# EAGLE design RH009.1 (EAGLE 7.1.0)
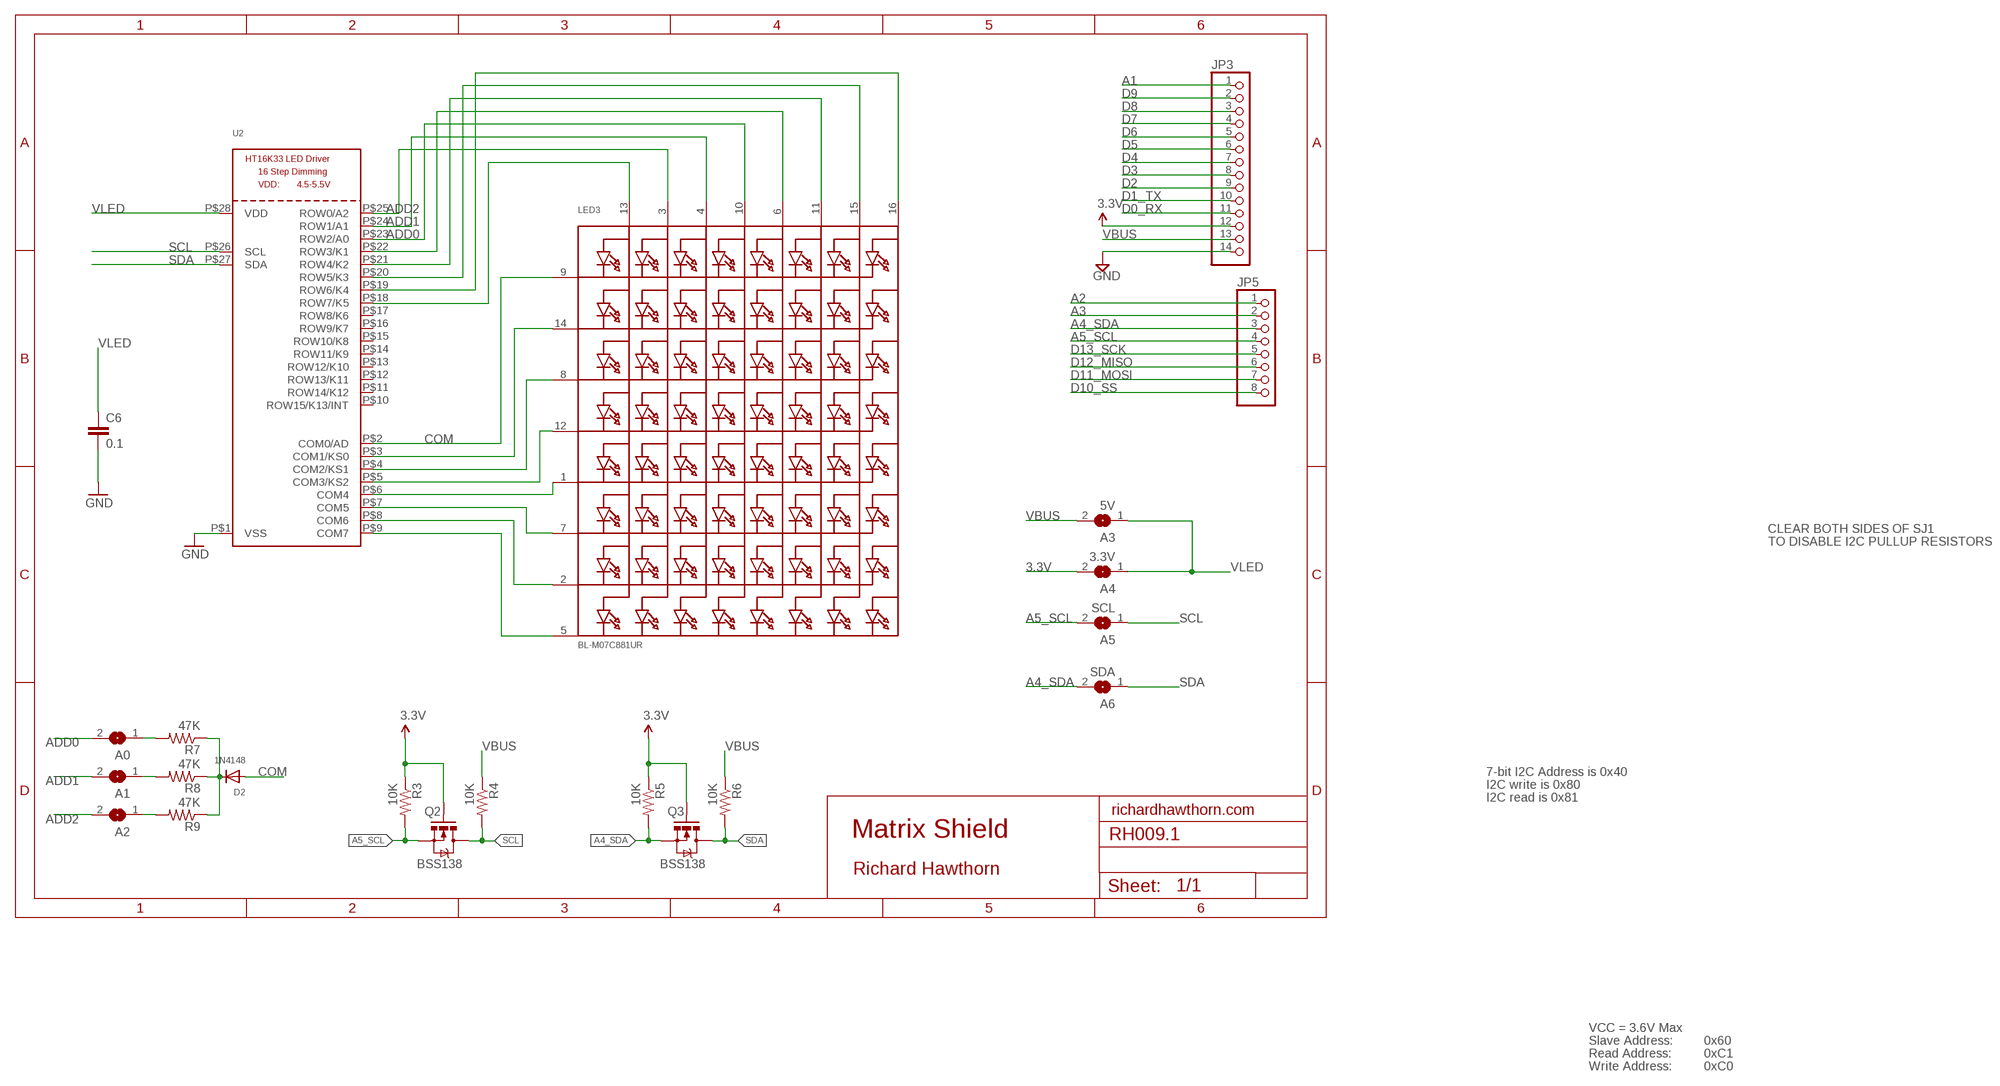
[diagram p0: schematic, sheet 1]

## Parts
A0  SOLDERJUMPERREFLOW_NOPASTE  [SOLDERJUMPER_REFLOW_NOPASTE]
A1  SOLDERJUMPERREFLOW_NOPASTE  [SOLDERJUMPER_REFLOW_NOPASTE]
A2  SOLDERJUMPERREFLOW_NOPASTE  [SOLDERJUMPER_REFLOW_NOPASTE]
A3  5V  SOLDERJUMPERREFLOW_NOPASTE  [SOLDERJUMPER_REFLOW_NOPASTE]
A4  3.3V  SOLDERJUMPERREFLOW_NOPASTE  [SOLDERJUMPER_REFLOW_NOPASTE]
A5  SCL  SOLDERJUMPERREFLOW_NOPASTE  [SOLDERJUMPER_REFLOW_NOPASTE]
A6  SDA  SOLDERJUMPERREFLOW_NOPASTE  [SOLDERJUMPER_REFLOW_NOPASTE]
C6  0.1  CAP0603-CAP  [0603-CAP]
D2  1N4148  DIODESOD-323F  [SOD-323F]
JP3  PINHD-1X14  [1X14]
JP5  PINHD-1X8  [1X08]
LED3  BL-M07C881UR  DISP_SEGMENT_8X8_ROWCATHODEM12A881UR  [SEGMENT_BL-M12A881UR]
Q2  BSS138  MOSFET-NCHANNELSMD  [SOT23-3]
Q3  BSS138  MOSFET-NCHANNELSMD  [SOT23-3]
R3  10K  RESISTOR0603-RES  [0603-RES]
R4  10K  RESISTOR0603-RES  [0603-RES]
R5  10K  RESISTOR0603-RES  [0603-RES]
R6  10K  RESISTOR0603-RES  [0603-RES]
R7  47K  R-US_R0805  [R0805]
R8  47K  R-US_R0805  [R0805]
R9  47K  R-US_R0805  [R0805]
U2  HT16K33_SOP28  [SOP28_300MIL]

## Nets
3.3V: A4.2 JP3.12 Q2.1(G) Q3.1(G) R3.1 R5.1
A1: JP3.1
A2: JP5.1
A3: JP5.2
A4_SDA: A6.2 JP5.3 Q3.2(S) R5.2
A5_SCL: A5.2 JP5.4 Q2.2(S) R3.2
ADD0: A0.2 LED3.10(A4) U2.P$23(ROW2/A0)
ADD1: A1.2 LED3.4(A3) U2.P$24(ROW1/A1)
ADD2: A2.2 LED3.3(A2) U2.P$25(ROW0/A2)
COM: D2.A LED3.9(K1) U2.P$2(COM0/AD)
D0_RX: JP3.11
D1_TX: JP3.10
D2: JP3.9
D3: JP3.8
D4: JP3.7
D5: JP3.6
D6: JP3.5
D7: JP3.4
D8: JP3.3
D9: JP3.2
D10_SS: JP5.8
D11_MOSI: JP5.7
D12_MISO: JP5.6
D13_SCK: JP5.5
GND [power]: C6.2 JP3.14 U2.P$1(VSS)
N$4: LED3.5(K8) U2.P$9(COM7)
N$5: A0.1 R7.2
N$6: LED3.2(K7) U2.P$8(COM6)
N$14: LED3.7(K6) U2.P$7(COM5)
N$17: D2.C R7.1 R8.1 R9.1
N$18: A2.1 R9.2
N$19: A1.1 R8.2
N$22: LED3.1(K5) U2.P$6(COM4)
N$23: LED3.12(K4) U2.P$5(COM3/KS2)
N$24: LED3.8(K3) U2.P$4(COM2/KS1)
N$25: LED3.14(K2) U2.P$3(COM1/KS0)
N$27: LED3.6(A5) U2.P$22(ROW3/K1)
N$28: LED3.11(A6) U2.P$21(ROW4/K2)
N$29: LED3.13(A1) U2.P$18(ROW7/K5)
SCL: A5.1 Q2.3(D) R4.2 U2.P$26(SCL)
SDA: A6.1 Q3.3(D) R6.2 U2.P$27(SDA)
SEG_F: LED3.15(A7) U2.P$20(ROW5/K3)
SEG_G: LED3.16(A8) U2.P$19(ROW6/K4)
VBUS [power]: A3.2 JP3.13 R4.1 R6.1
VLED [power]: A3.1 A4.1 C6.1 U2.P$28(VDD)
Unconnected: U2.P$10(ROW15/K13/INT) U2.P$11(ROW14/K12) U2.P$12(ROW13/K11) U2.P$13(ROW12/K10) U2.P$14(ROW11/K9) U2.P$15(ROW10/K8) U2.P$16(ROW9/K7) U2.P$17(ROW8/K6)

## Notes on the sheet
- CLEAR BOTH SIDES OF SJ1
- TO DISABLE I2C PULLUP RESISTORS
- 7-bit I2C Address is 0x40
- I2C write is 0x80
- I2C read is 0x81
- richardhawthorn.com
- Matrix Shield
- Richard Hawthorn
- VCC = 3.6V Max
- Slave Address: | 0x60
- Read Address: | 0xC1
- Write Address: | 0xC0

## Library data of the parts
A0 A1-A6 = microbuilder:SOLDERJUMPER: SMD Solder JUMPER Solder the two pads together to create a connection, or remove the solder to break it. REFLOW - Use this footprint for solder paste and reflow ovens. WAVE - Use this footprint for hand-soldering (larger pads). CLOSED - Has a trace between the two pads to ensure it is closed by default. The trace needs to be cut to disable the jumper, and can be closed again by creating a solder bridge between the two pads.
C6 = LowPowerLab:CAP: Capacitor Standard 0603 ceramic capacitor, and 0.1" leaded capacitor.
D2 = adafruit:DIODE: Diode SMADIODE - SMA Surface Mount Package 20V 1A Schottky Diode Digikey: 641-1014-6-ND DO-1N4148 - Through Hole Small Current Diode SOD-123 20V 1 A (.5mV Vf) Schottky Diode - Digikey: MBRX120TPMSCT-ND SOD-323 10V 570mA (.38mV Vf, 3ns) Schottky Diode - Digikey: ZLLS410CT-ND SOD-523 30V 30mA Schottky Diode (RB751S-40TE61) - Digikey: RB751S-40TE61CT-ND SOT23-R/W - SOT23 Package (R = Solder Paste/Reflow Ovens, W = Hand-Soldering) BAT54Film 40V 300mA - Digikey: 497-7162-1-ND
JP3 = pinhead:PINHD-1X14: PIN HEADER
JP5 = pinhead:PINHD-1X8: PIN HEADER
LED3 = microbuilder:DISP_SEGMENT_8X8_ROWCATHODE: 8x8 LED Segment Displays: Row = Cathode 0.7" Red 8X8 Matrix, 1.9mm Round LEDs - BL-M07C881UR 1.2" Red 8x8 Matrix, 3.0mm Round LEDs - BL-M12A881UR 1.2" Red 8x8 Matrix, 3.0mm Square LEDs - BL-M12A883
Q2 Q3 = SparkFun:MOSFET-NCHANNEL
R3-R6 = SparkFun:RESISTOR: Resistor Basic schematic elements and footprints for 0603, 1206, and PTH resistors.
R7-R9 = adafruit:R-US_: RESISTOR, American symbol
U2 = microbuilder:HT16K33_SOP28

## Net classes
1 power: width 0.381 mm, clearance 0.254 mm

## Board
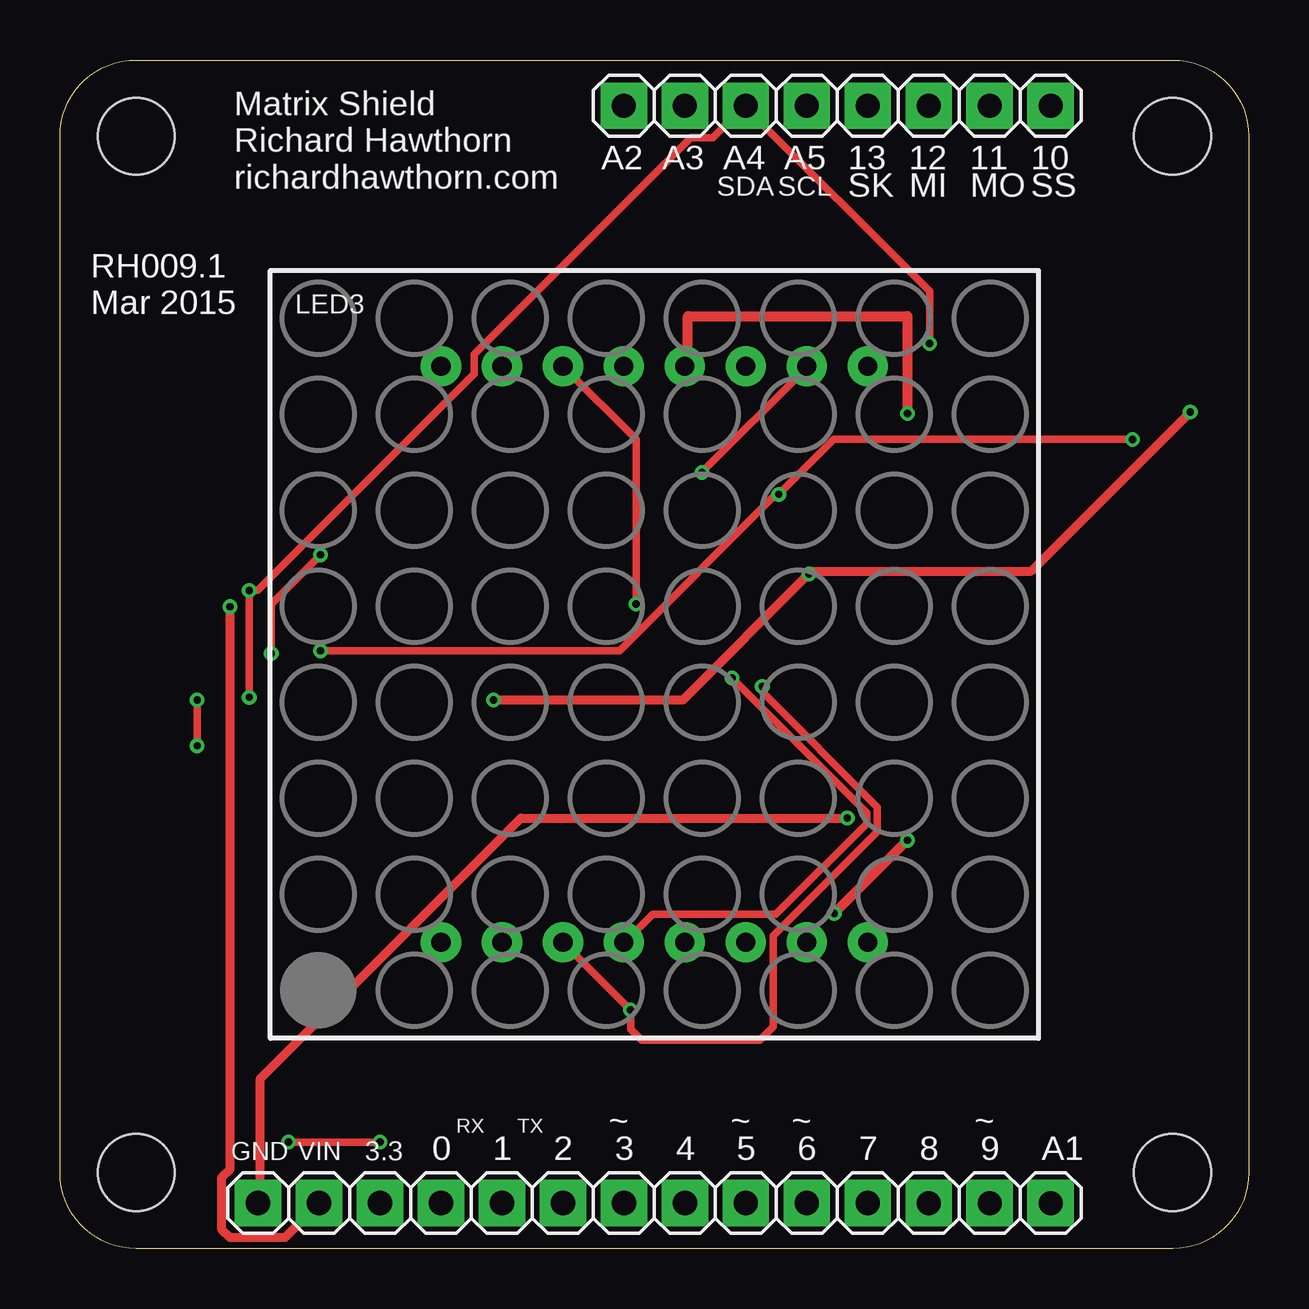
[diagram p1: board, top side]
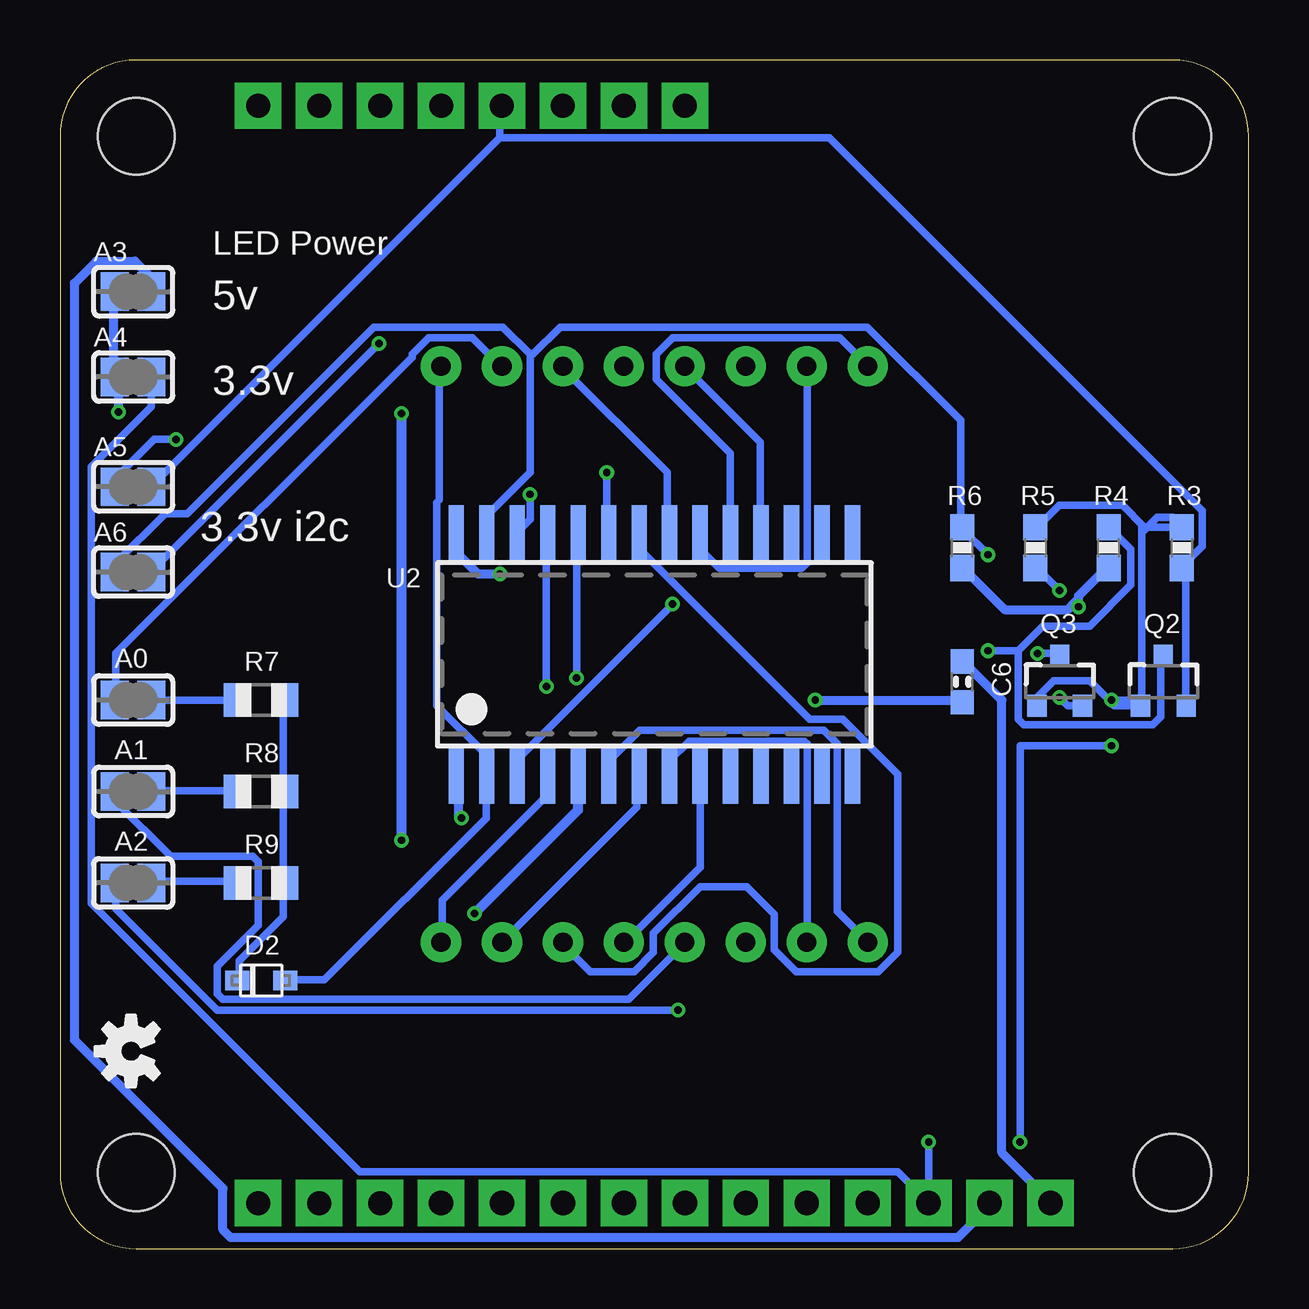
[diagram p2: board, bottom side, seen from below]

Size 49.53 x 49.53 mm. Coordinates in mm from the lower left corner, seen from the top.
Outline: 0,3.17 0,46.35 arc-90 3.17,49.53 46.35,49.53 arc-90 49.53,46.35 49.53,3.17 arc-90 46.35,0 3.17,0 arc-90 0,3.17
Copper layers (1*16): Top 0.035mm / dielectric 1.5mm / Bottom 0.035mm
Design rules "ITEADstudio_DRC *": minimum track width 12mil, minimum drill 12mil, track to track 6mil, track to pad 6mil, pad to pad 6mil, via to via 6mil, smd to smd 0mil, copper to edge 10mil, drill to drill 10mil, minimum pad ring 10mil, minimum via ring 6mil, stop-mask expansion 2mil, vias tented up to drill 100mil, thermal gap 15mil
Holes 3.2 mm at 3.17,3.17 46.35,3.17 3.17,46.35 46.35,46.35
tKeepout: area 0,0 to 5.7,5.7; area 43.8,0 to 49.5,5.7; area 43.8,43.8 to 49.5,49.5; area 0,43.8 to 5.7,49.5
bKeepout: area 0,43.8 to 5.7,49.5; area 43.8,43.8 to 49.5,49.5; area 43.8,0 to 49.5,5.7; area 0,0 to 5.7,5.7
tRestrict: area 24.3,8.9 to 29.1,12.8; area 5.8,16.9 to 6.9,18.5; area 5.2,9.7 to 6.7,10.4
bRestrict: area 27.4,17.7 to 29.2,18.7; area 21.1,13.8 to 22.9,14.9; area 21.6,12.6 to 22.1,13.2; area 20.7,12.6 to 21.2,13.2; area 20.2,12.8 to 20.7,13.5; area 20.1,13.4 to 20.6,14; area 26.5,18.9 to 27.1,19.5; area 26.5,17.9 to 27.1,18.5; area 27.5,19.1 to 28,19.8; area 27.9,18.8 to 29.1,19.6

### Footprints (pad centres in the part's own frame; a part is rotated, then mirrored left to right if it is on the bottom)
SOLDERJUMPER_REFLOW_NOPASTE = smd 1.168 x 1.6: 1 -0.762,0; 2 0.762,0
0603-CAP = smd 1.016 x 0.965: 1 -0.85,0; 2 0.85,0
SOD-323F = smd 1 x 0.8: A -1,0; C 1,0
1X14 = drill 1 pad 1.93 square: 1 -16.51,0; 2 -13.97,0; 3 -11.43,0 | drill 1.016 pad 1.93 square: 4 -8.89,0; 5 -6.35,0; 6 -3.81,0; 7 -1.27,0; 8 1.27,0; 9 3.81,0; 10 6.35,0; 11 8.89,0; 12 11.43,0; 13 13.97,0; 14 16.51,0
1X08 = drill 1 pad 1.93 square: 1 -8.89,0; 2 -6.35,0; 3 -3.81,0; 4 -1.27,0; 5 1.27,0; 6 3.81,0; 7 6.35,0; 8 8.89,0
SEGMENT_BL-M12A881UR = drill 0.8 pad 1.676: 1 -8.89,-12; 2 -6.35,-12; 3 -3.81,-12; 4 -1.27,-12; 5 1.27,-12; 6 3.81,-12; 7 6.35,-12; 8 8.89,-12; 9 8.89,12; 10 6.35,12; 11 3.81,12; 12 1.27,12; 13 -1.27,12; 14 -3.81,12; 15 -6.35,12; 16 -8.89,12
SOT23-3 = smd 0.8 x 0.9: 1 -0.95,-1; 2 0.95,-1; 3 0,1.1
0603-RES = smd 1.1 x 1: 1 -0.85,0; 2 0.85,0
R0805 = smd 1.1 x 1.4: 1 -1,0; 2 1,0
SOP28_300MIL = smd 0.635 x 2.286: P$1 -8.255,-5.08; P$2 -6.985,-5.08; P$3 -5.715,-5.08; P$4 -4.445,-5.08; P$5 -3.175,-5.08; P$6 -1.905,-5.08; P$7 -0.635,-5.08; P$8 0.635,-5.08; P$9 1.905,-5.08; P$10 3.175,-5.08; P$11 4.445,-5.08; P$12 5.715,-5.08; P$13 6.985,-5.08; P$14 8.255,-5.08; P$15 8.255,5.08; P$16 6.985,5.08; P$17 5.715,5.08; P$18 4.445,5.08; P$19 3.175,5.08; P$20 1.905,5.08; P$21 0.635,5.08; P$22 -0.635,5.08; P$23 -1.905,5.08; P$24 -3.175,5.08; P$25 -4.445,5.08; P$26 -5.715,5.08; P$27 -6.985,5.08; P$28 -8.255,5.08

### Placement (x,y rotation side)
A0  46.48,22.86 180 bottom
A1  46.48,19.05 180 bottom
A2  46.48,15.24 180 bottom
A3  46.48,39.88 0 bottom
A4  46.48,36.32 0 bottom
A5  46.48,31.75 0 bottom
A6  46.48,28.19 0 bottom
C6  11.94,23.62 90 bottom
D2  41.15,11.18 180 bottom
JP3  24.77,1.91 180 top
JP5  32.38,47.62 0 top
LED3  24.77,24.77 0 top
Q2  3.56,23.62 0 bottom
Q3  7.87,23.62 0 bottom
R3  2.79,29.21 270 bottom
R4  5.84,29.21 90 bottom
R5  8.89,29.21 270 bottom
R6  11.94,29.21 90 bottom
R7  41.15,22.86 180 bottom
R8  41.15,19.05 180 bottom
R9  41.15,15.24 180 bottom
U2  24.77,24.77 0 bottom
U$3  [OSHW-LOGO-S]  46.57,8.23 90 bottom

### Tracks (layer width: path | path; a pad name or v marks a point on that pad's centre or on a via)
3.3V  (via drill 0.3)
  Top 0.305: v5.71,20.95 v5.71,22.86 | v13.34,4.45 v9.53,4.45
  Bottom 0.305: A4.2 45.72,35.09 48.23,32.58 48.23,14.4 37.03,3.2 14.63,3.2 JP3.12 v13.34,4.45 | 4.57,22.63 5.6,22.63 5.77,22.8 | 5.77,22.8 6.63,23.66 8.12,23.66 8.8,22.97 8.8,22.63 Q3.1 | 4.34,30.06 2.86,30.06 | 4.34,30.06 5.26,30.98 7.89,30.98 8.8,30.06 R5.1 | 4.46,29.84 4.46,30.06 4.34,30.06 | 4.46,29.84 4.46,22.86 | 4.46,22.86 4.46,22.75 | 4.46,22.86 4.45,22.86 Q2.1 | 4.46,22.86 v5.71,22.86 5.77,22.8 | R3.1 3.17,30.48 3.81,30.48 4.45,29.84 4.46,29.84 | v5.71,20.95 9.53,20.95 v9.53,4.45
A4_SDA  (via drill 0.3)
  Top 0.305: v7.89,22.97 v7.89,27.43 8.23,27.43 17.26,36.46 17.26,37.26 26.29,46.29 27.2,46.29 28.46,47.55 JP5.3 28.57,47.55 36.23,39.89 v36.23,37.72
  Bottom 0.305: v7.89,22.97 7.54,22.63 6.97,22.63 Q3.2 | v7.89,27.43 8.8,28.35 R5.2 | v36.23,37.72 45.72,28.23 A6.2
A5_SCL
  Bottom 0.305: Q2.2 2.63,22.63 2.63,28.23 2.74,28.35 R3.2 2.74,28.46 1.94,29.26 1.94,30.75 17.49,46.29 31.2,46.29 | 31.2,46.29 45.72,31.77 A5.2 | 31.2,46.29 31.2,47.55 JP5.4
ADD0  (via drill 0.3)
  Top 0.305: v26.75,32.35 31.09,36.69 LED3.10
  Bottom 0.305: A0.2 47.21,22.86 47.21,24.8 34.86,37.15 34.86,37.26 34.18,37.95 32.35,37.95 31.2,36.8 LED3.10 | v26.75,32.35 26.75,29.95 U2.P$23
ADD1  (via drill 0.3)
  Top 0.305: v28,23.77 33.6,18.17 33.6,17.72 29.83,13.95 24.69,13.95 23.55,12.8 LED3.4
  Bottom 0.305: A1.2 47.21,18.97 47.21,18.63 44.92,16.34 41.49,16.34 41.26,16.12 41.26,13.49 42.98,11.77 42.98,10.63 42.75,10.4 25.83,10.4 23.55,12.69 LED3.4 | v28,23.77 28,29.83 U2.P$24
ADD2  (via drill 0.3)
  Top 0.305: LED3.3 21.03,12.69 v23.77,9.94 23.77,9.14 24.23,8.69 29.15,8.69 29.72,9.26 29.72,13.03 34.06,17.37 34.06,18.4 29.26,23.2 v29.26,23.43
  Bottom 0.305: v23.77,9.94 42.98,9.94 47.21,14.17 47.21,15.2 A2.2 | v29.26,23.43 29.26,29.83 U2.P$25
COM
  Bottom 0.305: D2.A 40.12,11.2 38.52,11.2 31.77,17.95 31.77,19.66 U2.P$2 31.77,19.77 31.77,20.57 33.83,22.63 33.83,31.09 33.72,31.2 33.72,36.69 LED3.9
GND  (via drill 0.3)
  Top 0.381: v32.8,17.95 19.2,17.95 8.34,7.09 8.34,1.94 JP3.14
  Bottom 0.381: C6.2 11.89,24.46 10.29,22.86 10.29,4 8.23,1.94 JP3.14 | v32.8,17.95 32.92,18.06 32.92,19.66 U2.P$1
N$4
  Bottom 0.305: U2.P$9 22.86,15.89 25.95,12.8 LED3.5
N$5
  Bottom 0.305: A0.1 R7.2
N$6
  Bottom 0.305: U2.P$8 24.12,19.77 24.12,20.34 23.32,21.14 18.52,21.14 18.4,21.03 18.4,12.8 LED3.2
N$14
  Bottom 0.305: U2.P$7 25.49,19.66 25.49,18.4 31.09,12.8 LED3.7
N$17
  Bottom 0.305: D2.C 42.06,11.2 42.06,12 40.23,13.83 40.23,15.2 R9.1 40.23,15.32 40.23,18.97 R8.1 40.23,19.09 40.23,22.86 R7.1
N$18
  Bottom 0.305: R9.2 42.18,15.32 45.72,15.32 A2.1
N$19
  Bottom 0.305: R8.2 42.18,19.09 45.72,19.09 A1.1
N$22
  Bottom 0.305: U2.P$6 26.63,19.77 26.63,20.34 25.38,21.6 17.72,21.6 17.14,21.03 17.14,14.06 15.89,12.8 LED3.1
N$23  (via drill 0.3)
  Top 0.406: LED3.12 26.16,36.77 26.16,38.86 35.31,38.86 v35.31,34.8 | v35.31,17.02 v32.26,13.97
  Bottom 0.406: v35.31,34.8 v35.31,17.02 | v32.26,13.97 27.94,18.29 U2.P$5
N$24
  Bottom 0.305: U2.P$4 29.26,19.66 29.26,18.86 33.6,14.52 33.6,12.8 LED3.8
N$25  (via drill 0.3)
  Top 0.305: v24,26.86 24,33.72 21.03,36.69 LED3.14
  Bottom 0.305: v24,26.86 30.4,20.46 30.4,19.77 U2.P$3
N$27
  Bottom 0.305: U2.P$22 25.38,29.83 25.38,29.15 18.29,22.06 16.92,22.06 14.63,19.77 14.63,12.34 15.43,11.54 18.86,11.54 19.77,12.46 19.77,13.95 20.92,15.09 22.86,15.09 24.8,13.14 24.8,12.34 25.6,11.54 27.43,11.54 28.57,12.69 LED3.6
N$28
  Bottom 0.305: U2.P$21 24.23,29.95 24.23,32.35 28.57,36.69 LED3.11
N$29
  Bottom 0.305: U2.P$18 20.34,29.95 20.34,33.6 23.43,36.69 LED3.13
SCL  (via drill 0.3)
  Top 0.305: v44.69,33.72 32.23,33.72 v29.95,31.43 29.83,31.43 23.32,24.92 v10.86,24.92
  Bottom 0.305: 9.6,24.92 9.6,22.06 9.37,21.83 4,21.83 3.66,22.17 3.66,24.69 Q2.3 | 9.6,24.92 8.57,25.95 6.63,25.95 4.92,27.66 4.92,29.15 5.83,30.06 R4.2 | v44.69,33.72 45.61,33.72 47.21,32.12 47.21,31.77 A5.1 | v29.95,31.43 29.95,30.4 30.4,29.95 U2.P$26 | v10.86,24.92 9.6,24.92
SDA  (via drill 0.3)
  Top 0.305: v8.8,24.8 8.8,26.86 v10.86,28.92
  Bottom 0.305: v8.8,24.8 7.89,24.8 Q3.3 | v10.86,28.92 11.89,29.95 R6.2 12,30.18 12,34.52 15.89,38.41 28.69,38.41 29.83,37.26 29.95,37.26 | 29.95,37.26 31.09,38.41 36.46,38.41 44.23,30.63 45.15,30.63 47.21,28.57 47.21,28.23 A6.1 | 29.95,37.26 29.95,32.35 31.66,30.63 31.66,29.95 U2.P$27
SEG_F
  Bottom 0.305: U2.P$20 22.86,29.15 22.06,28.35 18.63,28.35 18.4,28.57 18.4,36.69 LED3.15
SEG_G
  Bottom 0.305: U2.P$19 21.6,29.95 21.6,33.15 24.69,36.23 24.69,37.26 24,37.95 17.03,37.95 15.89,36.8 LED3.16
VBUS  (via drill 0.3)
  Top 0.381: v7.09,26.75 7.09,3.31 6.74,2.97 6.74,0.8 7.09,0.46 9.37,0.46 10.74,1.83 JP3.13
  Bottom 0.381: 7.2,26.98 7.54,26.63 10.17,26.63 11.89,28.35 R6.1 | 7.2,26.98 7.09,27.09 7.09,27.2 5.94,28.35 R4.1 | A3.2 45.72,40.46 46.41,41.15 48.01,41.15 48.92,40.23 48.92,8.69 42.75,2.52 42.75,0.8 42.41,0.46 12.12,0.46 10.74,1.83 10.86,1.94 JP3.13 | v7.09,26.75 7.09,26.86 7.2,26.98
VLED  (via drill 0.3)
  Top 0.381: v18.06,22.86 25.95,22.86 v31.2,28.12 31.32,28.23 40.46,28.23 v47.09,34.86
  Bottom 0.381: A3.1 47.32,39.78 47.32,36.35 A4.1 47.09,36.23 v47.09,34.86 | v18.06,22.86 12,22.86 C6.1 | v31.2,28.12 32.12,28.12 32.92,28.92 32.92,29.83 U2.P$28

### Text on the board
tNames: A2 | A3 | A4 | A5 | 13 | 12 | 11 | 10 | Matrix Shield / Richard Hawthorn / richardhawthorn.com | SDA | SCL | SK | MI | MO | SS | RH009.1 / Mar 2015 | RX | TX | ~ | ~ | ~ | ~ | GND | VIN | 3.3 | 0 | 1 | 2 | 3 | 4 | 5 | 6 | 7 | 8 | 9 | A1
bNames: LED Power | 5v | 3.3v | 3.3v i2c
tDocu: REG